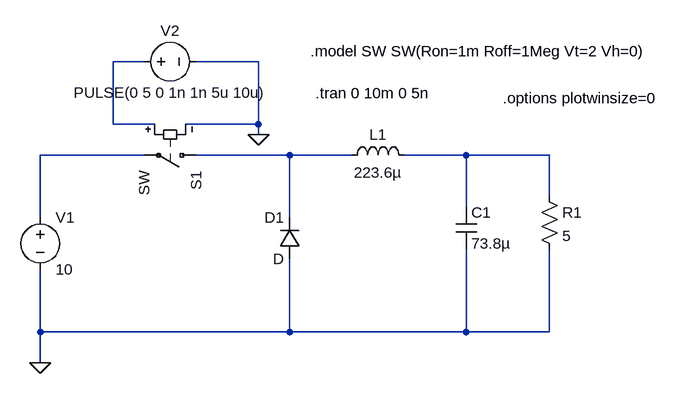
[diagram p0: schematic Buck.asc]
Buck.asc, the LTspice schematic file:
Version 4
SHEET 1 1132 680
WIRE 336 64 288 64
WIRE 512 64 416 64
WIRE 288 160 288 64
WIRE 352 160 288 160
WIRE 512 160 512 64
WIRE 512 160 400 160
WIRE 512 176 512 160
WIRE 336 208 176 208
WIRE 560 208 416 208
WIRE 656 208 560 208
WIRE 832 208 736 208
WIRE 960 208 832 208
WIRE 960 272 960 208
WIRE 832 288 832 208
WIRE 176 304 176 208
WIRE 560 304 560 208
WIRE 176 480 176 384
WIRE 560 480 560 368
WIRE 560 480 176 480
WIRE 832 480 832 352
WIRE 832 480 560 480
WIRE 960 480 960 352
WIRE 960 480 832 480
WIRE 176 528 176 480
FLAG 176 528 0
FLAG 512 176 0
SYMBOL voltage 176 288 R0
SYMATTR InstName V1
SYMATTR Value 10
SYMBOL sw 432 208 R90
SYMATTR InstName S1
SYMBOL diode 576 368 R180
WINDOW 0 24 64 Left 2
WINDOW 3 24 0 Left 2
SYMATTR InstName D1
SYMBOL ind 640 224 R270
WINDOW 0 32 56 VTop 2
WINDOW 3 5 56 VBottom 2
SYMATTR InstName L1
SYMATTR Value 223.6µ
SYMBOL Cap 816 288 R0
SYMATTR InstName C1
SYMATTR Value 73.8µ
SYMBOL Res 944 256 R0
SYMATTR InstName R1
SYMATTR Value 5
SYMBOL voltage 320 64 R270
WINDOW 0 32 56 VTop 2
WINDOW 3 -32 56 VBottom 2
SYMATTR InstName V2
SYMATTR Value PULSE(0 5 0 1n 1n 5u 10u)
TEXT 592 48 Left 2 !.model SW SW(Ron=1m Roff=1Meg Vt=2 Vh=0)
TEXT 600 112 Left 2 !.tran 0 10m 0 5n
TEXT 888 120 Left 2 !.options plotwinsize=0

The netlist it stands for:
* Buck.asc
V1 N002 0 10
S1 N003 N002 N001 0 SW
D1 0 N003 D
L1 N003 N004 223.6µ
C1 N004 0 73.8µ
R1 N004 0 5
V2 N001 0 PULSE(0 5 0 1n 1n 5u 10u)
.model D D
.lib standard.dio
.model SW SW(Ron=1m Roff=1Meg Vt=2 Vh=0)
.tran 0 10m 0 5n
.options plotwinsize=0
.backanno
.end